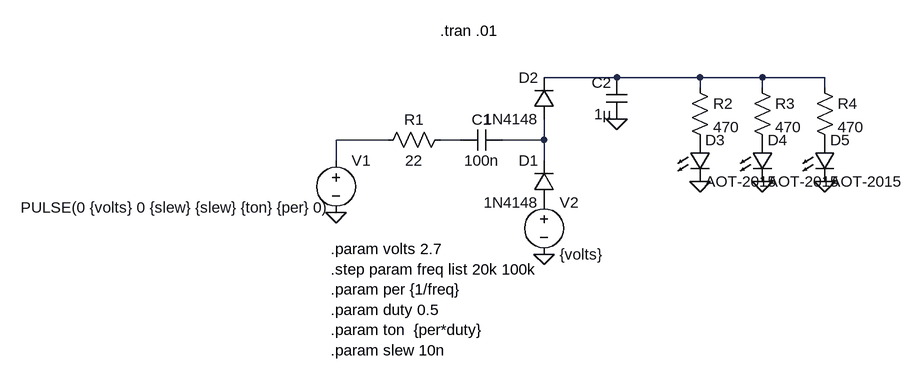
[diagram p0: schematic Charge Pump.asc]
Charge Pump.asc, the LTspice schematic file:
Version 4
SHEET 1 888 680
WIRE 432 16 320 16
WIRE 560 16 432 16
WIRE 656 16 560 16
WIRE 752 16 656 16
WIRE 560 32 560 16
WIRE 656 32 656 16
WIRE 752 32 752 16
WIRE 80 112 0 112
WIRE 192 112 160 112
WIRE 320 112 320 80
WIRE 320 112 256 112
WIRE 0 144 0 112
WIRE 320 144 320 112
FLAG 432 80 0
FLAG 320 288 0
FLAG 0 224 0
FLAG 560 176 0
FLAG 656 176 0
FLAG 752 176 0
SYMBOL voltage 0 128 R0
WINDOW 3 -485 88 Left 2
WINDOW 123 0 0 Left 2
WINDOW 39 0 0 Left 2
SYMATTR InstName V1
SYMATTR Value PULSE(0 {volts} 0 {slew} {slew} {ton} {per} 0)
SYMBOL res 176 96 R90
WINDOW 0 0 56 VBottom 2
WINDOW 3 32 56 VTop 2
SYMATTR InstName R1
SYMATTR Value 22
SYMBOL diode 336 80 R180
WINDOW 0 24 64 Left 2
WINDOW 3 24 0 Left 2
SYMATTR InstName D2
SYMATTR Value 1N4148
SYMBOL cap 256 96 R90
WINDOW 0 0 32 VBottom 2
WINDOW 3 32 32 VTop 2
SYMATTR InstName C1
SYMATTR Value 100n
SYMBOL cap 448 80 R180
WINDOW 0 24 56 Left 2
WINDOW 3 24 8 Left 2
SYMATTR InstName C2
SYMATTR Value 1µ
SYMBOL LED 544 112 R0
SYMATTR InstName D3
SYMATTR Value AOT-2015
SYMBOL res 544 16 R0
SYMATTR InstName R2
SYMATTR Value 470
SYMBOL res 640 16 R0
SYMATTR InstName R3
SYMATTR Value 470
SYMBOL res 736 16 R0
SYMATTR InstName R4
SYMATTR Value 470
SYMBOL LED 640 112 R0
SYMATTR InstName D4
SYMATTR Value AOT-2015
SYMBOL LED 736 112 R0
SYMATTR InstName D5
SYMATTR Value AOT-2015
SYMBOL diode 336 208 R180
WINDOW 0 24 64 Left 2
WINDOW 3 24 0 Left 2
SYMATTR InstName D1
SYMATTR Value 1N4148
SYMBOL voltage 320 192 R0
SYMATTR InstName V2
SYMATTR Value {volts}
TEXT 160 -56 Left 2 !.tran .01
TEXT -8 280 Left 2 !.param volts 2.7\n.step param freq list 20k 100k\n.param per {1/freq}\n.param duty 0.5\n.param ton  {per*duty}\n.param slew 10n

The netlist it stands for:
* Charge Pump.asc
V1 N002 0 PULSE(0 {volts} 0 {slew} {slew} {ton} {per} 0)
R1 N003 N002 22
D2 N004 N001 1N4148
C1 N004 N003 100n
C2 0 N001 1µ
D3 P001 0 AOT-2015
R2 N001 P001 470
R3 N001 P002 470
R4 N001 P003 470
D4 P002 0 AOT-2015
D5 P003 0 AOT-2015
D1 P004 N004 1N4148
V2 P004 0 {volts}
.model D D
.lib standard.dio
.tran .01
.param volts 2.7
.step param freq list 20k 100k
.param per {1/freq}
.param duty 0.5
.param ton  {per*duty}
.param slew 10n
.backanno
.end